# EasyEDA Pro project Projeto PCI - TCC Felipe_REV01.eprj

# Schematic Schematic1
Board Name: PCB2; Create Date: 2025-04-14; Page Name: P1; Project Name: TCC Felipe; Schematic Name: Schematic1; Update Date: 2025-06-02; Company: EasyEDA.com; Page Size: A4; Version: V1.0
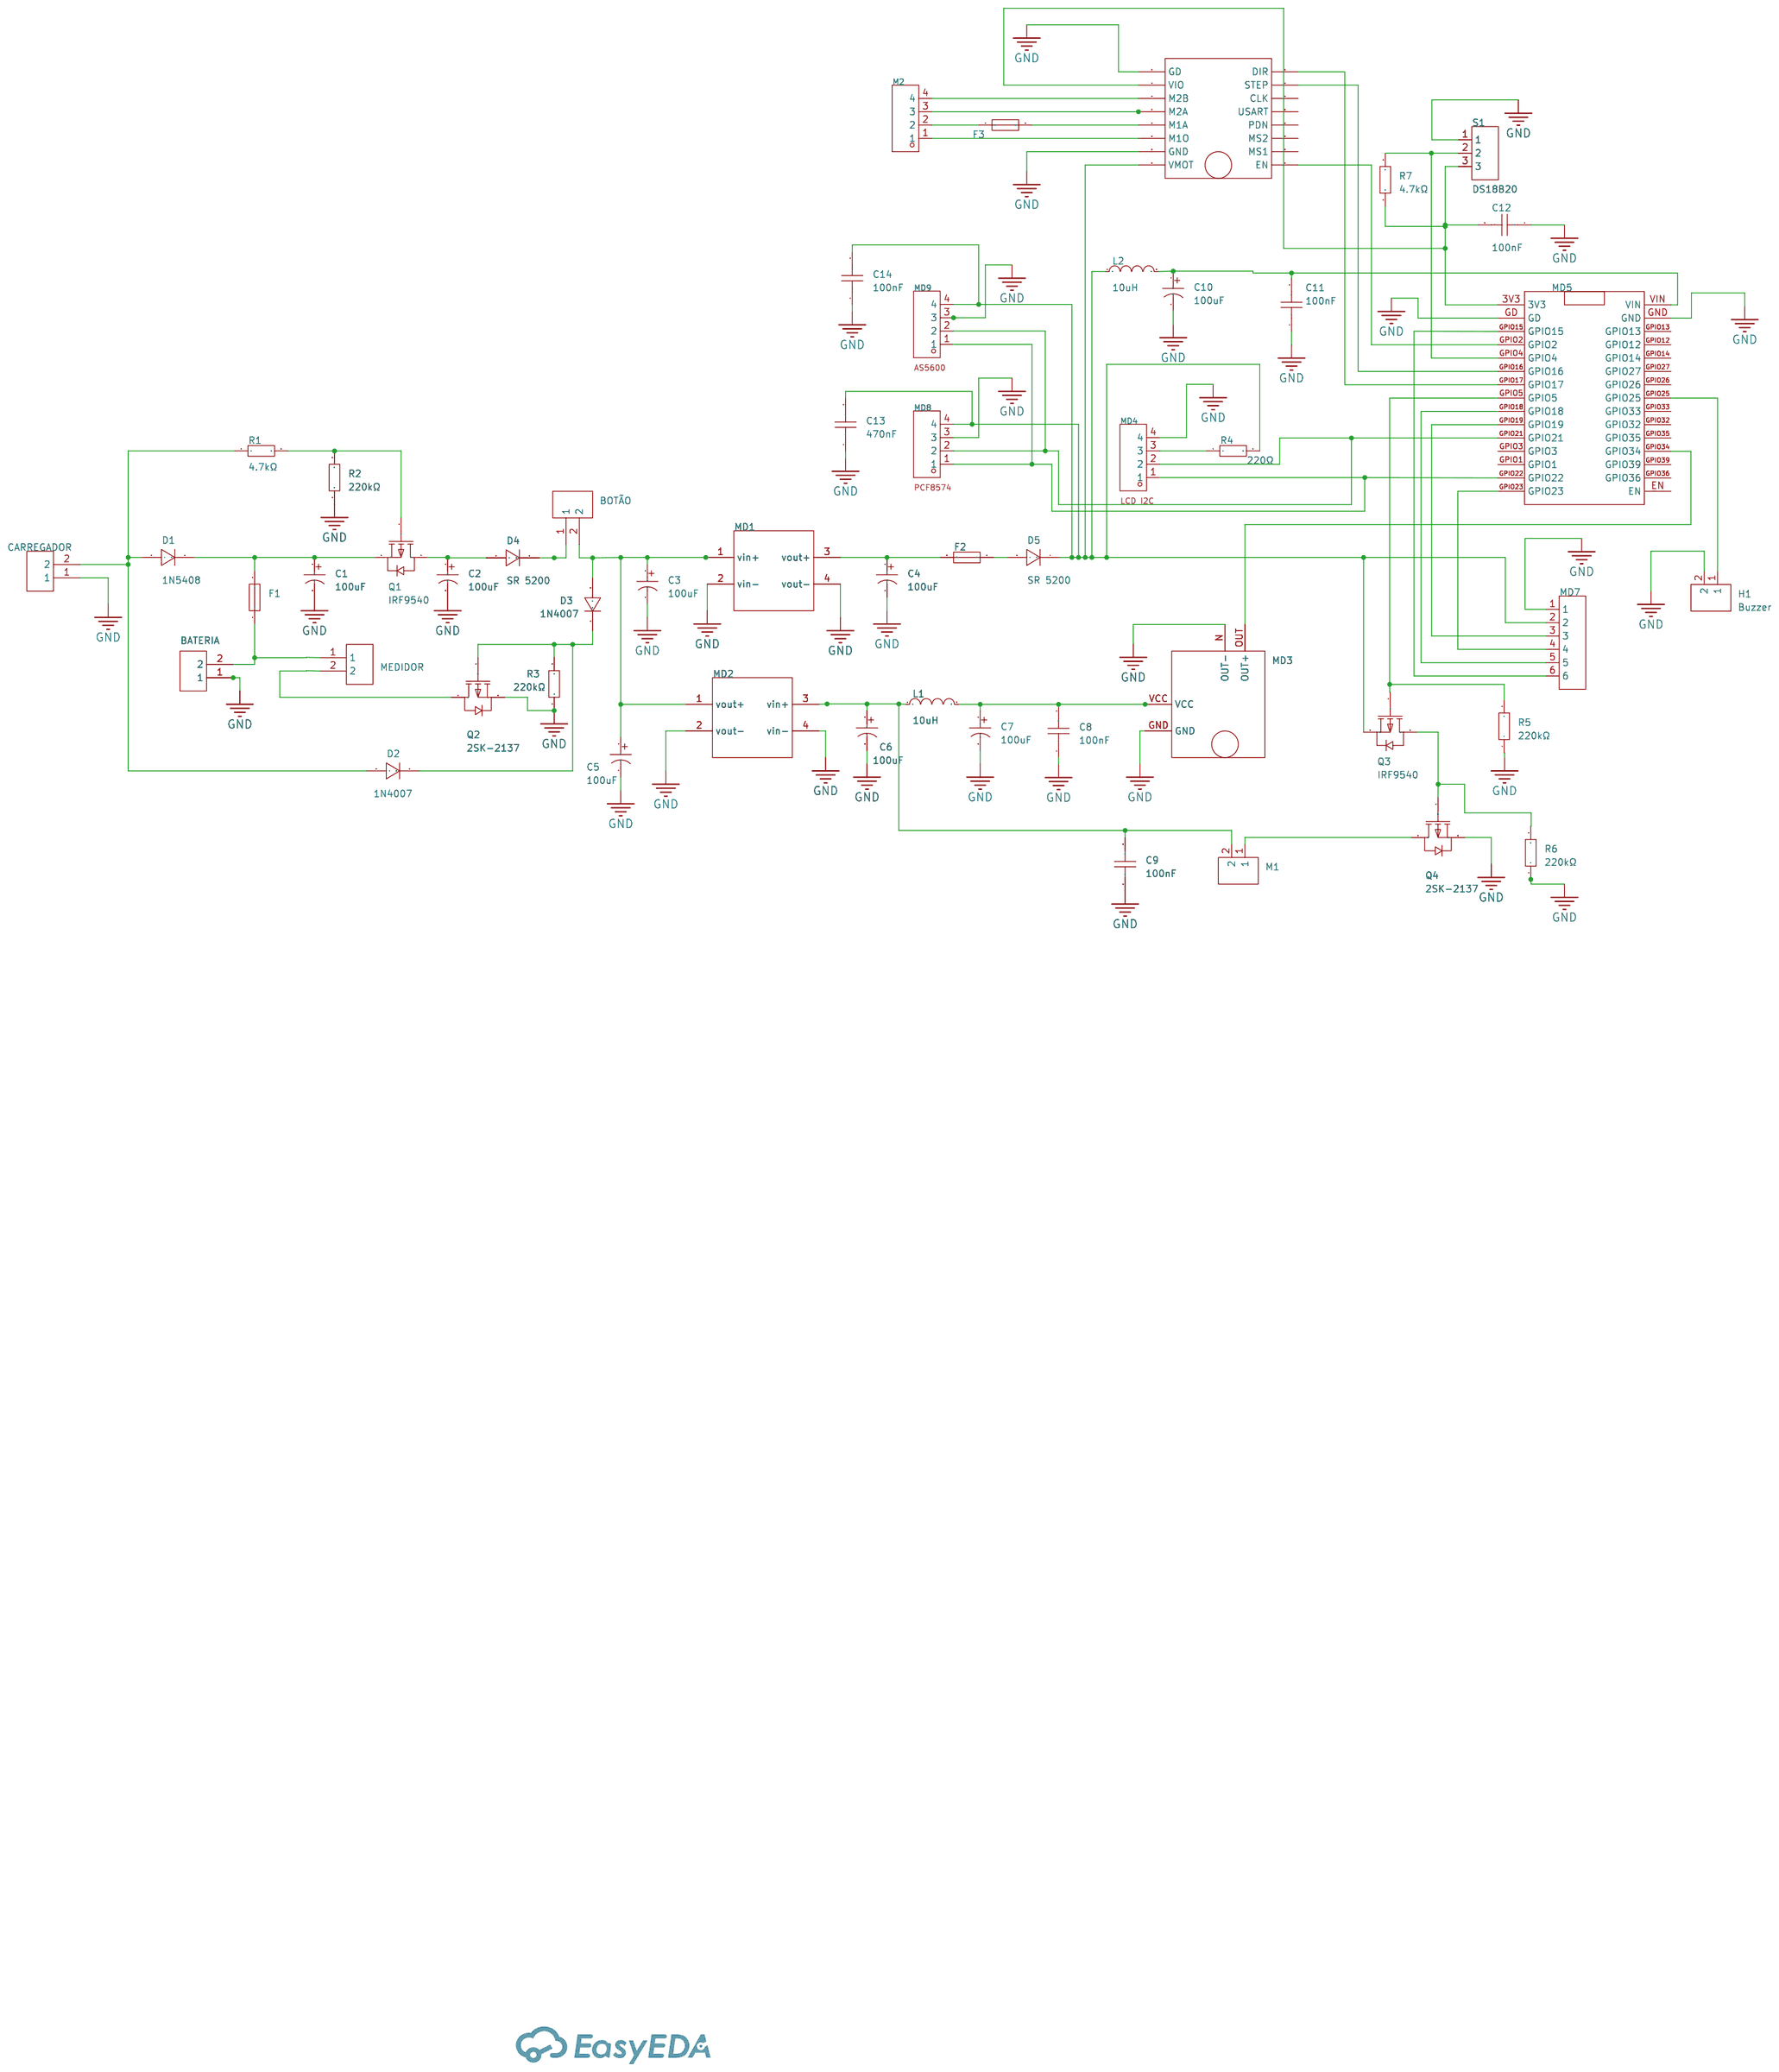
[diagram p0: schematic sheet]

## Parts
BATERIA  WJ500V-5.08-2P  [CONN-TH_2P-P5.00_WJ500V-5.08-2P]
BOTÃO  WJ500V-5.08-2P  [CONN-TH_2P-P5.00_WJ500V-5.08-2P]
C1  100uF  [CAP-TH_BD5.0-P2.00-D0.8-FD]
C2  100uF  [CAP-TH_BD5.0-P2.00-D0.8-FD]
C3  100uF  [CAP-TH_BD5.0-P2.00-D0.8-FD]
C4  100uF  [CAP-TH_BD5.0-P2.00-D0.8-FD]
C5  100uF  [CAP-TH_BD5.0-P2.00-D0.8-FD]
C6  100uF  [CAP-TH_BD5.0-P2.00-D0.8-FD]
C7  100uF  [CAP-TH_BD5.0-P2.00-D0.8-FD]
C8  100nF  [CAP-TH_L4.8-W2.4-P5.08-D0.6]
C9  100nF  [CAP-TH_L4.8-W2.4-P5.08-D0.6]
C10  100uF  [CAP-TH_BD5.0-P2.00-D0.8-FD]
C11  100nF  [CAP-TH_L4.8-W2.4-P5.08-D0.6]
C12  100nF  [CAP-TH_L4.8-W2.4-P5.08-D0.6]
C13  470nF  [CAP-TH_L4.8-W2.4-P5.08-D0.6]
C14  100nF  [CAP-TH_L4.8-W2.4-P5.08-D0.6]
CARREGADOR  WJ500V-5.08-2P  [CONN-TH_2P-P5.00_WJ500V-5.08-2P]
D1  1N5408  [DO-201_BD5.3-L9.5-P13.50-D1.4-RD]
D2  1N4007  [DO-201_BD5.3-L9.5-P13.50-D1.4-RD]
D3  1N4007  [DO-201_BD5.3-L9.5-P13.50-D1.4-RD]
D4  SR 5200  [DO-201_BD5.3-L9.5-P13.50-D1.4-RD]
D5  SR 5200  [DO-201_BD5.3-L9.5-P13.50-D1.4-RD]
F1  FH1-200CK-B  [FUSE-TH_L24.8-W9.8-P22.60]
F2  FH1-200CK-B  [FUSE-TH_L24.8-W9.8-P22.60]
F3  Fuse SPT478T400mA250V  [FUSE-TH_L8.4-W4.1-P5.08-D0.6]
H1  Buzzer  [HDR-TH_2P-P2.54-V-M]
L1  10uH  [axial inductor]
L2  10uH  [axial inductor]
M1  PH2.54-1X2P-H25  [HDR-TH_2P-P2.54-V-M-4]
M2  PZ254V-11-04P  [HDR-TH_4P-P2.54-V-M]
MD1  Xl4015  [Modulo Conversor Dc Step Down Abaixador 5a Xl4015]
MD2  SDB628  [Regulador de Tensão SDB628 Step Up]
MD3  AD8313  [AD8313]
MD4  2.54-1*4P母  [HDR-TH_4P-P2.54-V-F]
MD5  ESP32  [ESP32 DEV MODE]
MD6  TMC2208  [TMC2208]
MD7  HX PM2.54-1x6P ZC H11  [HDR-TH_6P-P2.54-V-F_4]
MD8  2.54-1*4P母  [HDR-TH_4P-P2.54-V-F]
MD9  2.54-1*4P母  [HDR-TH_4P-P2.54-V-F]
MEDIDOR  WJ500V-5.08-2P  [CONN-TH_2P-P5.00_WJ500V-5.08-2P]
Q1  IRF9540  [TO-220-3_L9.9-W4.5-P2.54-L-1]
Q2  2SK-2137  [TO-220-3_L10.0-W4.5-P2.54-L]
Q3  IRF9540  [TO-220-3_L9.9-W4.5-P2.54-L-1]
Q4  2SK-2137  [TO-220-3_L10.0-W4.5-P2.54-L]
R1  4.7kΩ  [RES-TH_BD2.3-L6.5-P10.50-D0.5]
R2  220kΩ  [RES-TH_BD2.3-L6.5-P10.50-D0.5]
R3  220kΩ  [RES-TH_BD2.3-L6.5-P10.50-D0.5]
R4  220Ω  [RES-TH_BD2.3-L6.5-P10.50-D0.5]
R5  220kΩ  [RES-TH_BD2.3-L6.5-P10.50-D0.5]
R6  220kΩ  [RES-TH_BD2.3-L6.5-P10.50-D0.5]
R7  4.7kΩ  [RES-TH_BD2.3-L6.5-P10.50-D0.5]
S1  DS18B20  [HDR-TH_3P-P2.54-V-F]

## Library data of the parts
BATERIA BOTÃO CARREGADOR MEDIDOR = WJ500V-5.08-2P: LCSC Part Name: 1x2P 5.08mm 直插 排数:1 每排P数:2; Supplier Part: C8465; Manufacturer: KANGNEX(康奈克斯电气); Supplier Footprint: 插件,P=5.08mm; JLCPCB Part Class: Extended Part; Datasheet: https://atta.szlcsc.com/upload/public/pdf/source/20191225/C8465_02D34CE5B5B4A53DF5891601D97FA9F4.pdf; Supplier: LCSC; Structure: 1x2P; Pitch: 5.08mm; Color: Green; Mounting Style: Direct Insert; Current Rating (Max): 18A; Voltage Rating (Max): 250V; Number of Pins: 2P; Number of Rows: 1; Wire Gauge - AWG: 14~30; Wire Gauge - mm2: 2.5; Number of PINs Per Row: 2; Operating Temperature Range: -40℃~+105℃; Screw Specification: M2.5
C1-C7 C10 = KS107M016D07RR0VH2FP0: LCSC Part Name: 100uF ±20% 16V; Supplier Part: C43803; Manufacturer: CX(承兴); Supplier Footprint: 插件,D5xL7mm; JLCPCB Part Class: Extended Part; Datasheet: https://atta.szlcsc.com/upload/public/pdf/source/20230817/0DB19D47181DB7F2222DAA6444591EF5.pdf; Supplier: LCSC; Tolerance: ±20%; Lifetime @ Temp: 1000hrs@105℃; Operating Temperature: -40℃~+105℃
C8 C9 C11-C14 = 178MU0009: LCSC Part Name: 470nF ±10% 50V; Supplier Part: C5632433; Manufacturer: KNSCHA(科尼盛); Supplier Footprint: 插件,P=5.08mm; JLCPCB Part Class: Extended Part; Datasheet: https://atta.szlcsc.com/upload/public/pdf/source/20230506/DCC14A9A0FEAEE97AA63FFA7A16A3B41.pdf; Supplier: LCSC; Tolerance: ±10%; Voltage Rating: 50V; Temperature Coefficient: X7R
D1 = 1N5408_C82807: Supplier Part: C82807; Manufacturer: LRC(乐山无线电); Supplier Footprint: DO-201AD; JLCPCB Part Class: Extended Part; Datasheet: https://atta.szlcsc.com/upload/public/pdf/source/20161024/1477288469472.pdf; Supplier: LCSC; Diode Configuration: Independent Type; Voltage - Forward(Vf@If): 1.2V@3A; Current - Rectified: 3A; Reverse Leakage Current (Ir): 5uA@1kV
D2-D5 = 1N5408_C82807: LCSC Part Name: 1N5408; Supplier Part: C82807; Manufacturer: LRC(乐山无线电); Supplier Footprint: DO-201AD; JLCPCB Part Class: Extended Part; Datasheet: https://atta.szlcsc.com/upload/public/pdf/source/20161024/1477288469472.pdf; Supplier: LCSC; Diode Configuration: Independent Type; Voltage - Forward(Vf@If): 1.2V@3A; Current - Rectified: 3A; Reverse Leakage Current (Ir): 5uA@1kV
F1 F2 = FH1-200CK-B: LCSC Part Name: 两件套 保险丝夹5*20黑色（两件套）; Supplier Part: C268205; Manufacturer: HONGJU(宏聚); Supplier Footprint: 插件; JLCPCB Part Class: Extended Part; Datasheet: https://atta.szlcsc.com/upload/public/pdf/source/20190802/C268205_A421C231E53844EC97EC198CC4695A68.pdf; Supplier: LCSC
F3 = Fuse SPT478T400mA250V: Type:Square Fuse Current Rating:400mA Voltage Rating (AC):250V Voltage Rating (DC):125V Operating Temperature:-55℃~+125℃ Operating Temperature:-55℃~+125℃ Interrupt Rating:150A@250VAC; LCSC Part Name: 400mA 250VAC 慢断; Supplier Part: C2995764; Manufacturer: SET(赛尔特); Supplier Footprint: 插件; JLCPCB Part Class: Extended Part; Datasheet: https://atta.szlcsc.com/upload/public/pdf/source/20220512/1DE9E7A91927E3FAADADA621F21C7EED.pdf; Supplier: LCSC; Type: Square Fuse; Current Rating: 400mA; Voltage Rating (AC): 250V; Voltage Rating (DC): 125V; Operating Temperature: -55℃~+125℃; Interrupt Rating: 150A@250VAC
H1 = PZ254V-11-02P: LCSC Part Name: 1x2P 间距:2.54mm 方针 直插; Supplier Part: C492401; Manufacturer: XFCN(兴飞); Supplier Footprint: 插件,P=2.54mm; JLCPCB Part Class: Extended Part; Datasheet: https://atta.szlcsc.com/upload/public/pdf/source/20200309/C492401_A812433581A9B211A7FFA413ADDFF0E5.pdf; Supplier: LCSC; Pin Structure: 1x2P; Pitch: 2.54mm; Circluar Pins/Square Pins: Policy; Mounting Type: Straight; Number of Rows: Single Row; Number of Pins: 2P; Length of Mating Pin: 6mm; Insulation Height: 2.5mm; Length of End Connection Pin: 3mm; Contact Material: Brass; Operating Temperature: -40℃~+105℃; Color: Black
L1 L2 = axial inductor
M1 = PH2.54-1X2P-H25: Supplier Part: C42431798; Manufacturer: JXTCONN(聚兴泰); Supplier Footprint: 插件,P=2.54mm; Datasheet: https://atta.szlcsc.com/upload/public/pdf/source/20241230/202EFE71BA0218E4180A97322F8770D7.pdf; Supplier: LCSC
M2 = PZ254V-11-04P: LCSC Part Name: 间距:2.54mm 1x4P 直插 方针; Supplier Part: C2691448; Manufacturer: XFCN(兴飞); Supplier Footprint: 插件,P=2.54mm; JLCPCB Part Class: Extended Part; Datasheet: https://atta.szlcsc.com/upload/public/pdf/source/20200309/C492403_F9F19131791D08044AD4F84F8E751A34.pdf; Supplier: LCSC; Pin Structure: 1x4P; Pitch: 2.54mm; Circluar Pins/Square Pins: Square Pins; Mounting Type: Straight; Number of Rows: Plugin; Number of Pins: 4P; Current Rating (Max): 3A; Voltage Rating (Max): 250V; Length of Mating Pin: 6mm; Insulation Height: 2.5mm; Length of End Connection Pin: 3mm; Operating Temperature Range: -40℃~+105℃; Color: Black
MD1 = Module  Xl4015
MD2 = Regulador de Tensão SDB628 Step Up
MD3 = módulo da detecção da radiofrequência AD8313
MD4 = 2.54-1*4P母: LCSC Part Name: 间距:2.54mm 1x4P 直插; Supplier Part: C2718488; Manufacturer: LCD I2C; Supplier Footprint: 插件,P=2.54mm; JLCPCB Part Class: Extended Part; Datasheet: https://atta.szlcsc.com/upload/public/pdf/source/20210301/C2718488_F4427B881E42CAA8DDB0B1C12B3A522C.pdf; Supplier: LCSC; Holes Structure: 1x4P; Pitch: 2.54mm; Circular Hole / Square Hole: Square Holes; Mounting Type: Straight; Number of Rows: Plugin; Number of Holes: 4P; Current Rating (Max): 3A; Holes Direction: Top; Contact Material: bronze; Operating Temperature Range: -40℃~+105℃
MD5 = ESP32 DEV MODE
MD6 = Driver Motor de Passo TMC2208
MD7 = HX PM2.54-1x6P ZC H11: LCSC Part Name: 1x6P 间距:2.54mm 直插; Supplier Part: C41427521; Manufacturer: hanxia(韩下); Supplier Footprint: 插件,P=2.54mm; JLCPCB Part Class: Extended Part; Datasheet: https://atta.szlcsc.com/upload/public/pdf/source/20241011/FC6480F416A05A484ECA158C50450AEF.pdf; Supplier: LCSC; Holes Structure: 1x6P; Pitch: 2.54mm; Circular Hole / Square Hole: Square Hole; Mounting Type: Direct Insert; Number of Rows: Single Row; Number of Positions: 6P; Current Rating: 3A; Holes Direction: Top; Insulation Height: 11mm; Contact Plating: Gold; Operating Temperature: -40℃~+105℃; PIN Length: 3.2mm
MD8 = 2.54-1*4P母: LCSC Part Name: 间距:2.54mm 1x4P 直插; Supplier Part: C2718488; Manufacturer: PCF8574; Supplier Footprint: 插件,P=2.54mm; JLCPCB Part Class: Extended Part; Datasheet: https://atta.szlcsc.com/upload/public/pdf/source/20210301/C2718488_F4427B881E42CAA8DDB0B1C12B3A522C.pdf; Supplier: LCSC; Holes Structure: 1x4P; Pitch: 2.54mm; Circular Hole / Square Hole: Square Holes; Mounting Type: Straight; Number of Rows: Plugin; Number of Holes: 4P; Current Rating (Max): 3A; Holes Direction: Top; Contact Material: bronze; Operating Temperature Range: -40℃~+105℃
MD9 = 2.54-1*4P母: LCSC Part Name: 间距:2.54mm 1x4P 直插; Supplier Part: C2718488; Manufacturer: AS5600; Supplier Footprint: 插件,P=2.54mm; JLCPCB Part Class: Extended Part; Datasheet: https://atta.szlcsc.com/upload/public/pdf/source/20210301/C2718488_F4427B881E42CAA8DDB0B1C12B3A522C.pdf; Supplier: LCSC; Holes Structure: 1x4P; Pitch: 2.54mm; Circular Hole / Square Hole: Square Holes; Mounting Type: Straight; Number of Rows: Plugin; Number of Holes: 4P; Current Rating (Max): 3A; Holes Direction: Top; Contact Material: bronze; Operating Temperature Range: -40℃~+105℃
Q1 Q3 = IRF9540_C7496537: LCSC Part Name: P沟道,电流:-20A,耐压:-100V; Supplier Part: C7496537; Manufacturer: Slkor(萨科微); Supplier Footprint: TO-220; JLCPCB Part Class: Extended Part; Datasheet: https://atta.szlcsc.com/upload/public/pdf/source/20230809/310EFFAEBFCCC294A87EA71D86FED7F8.pdf; Supplier: LCSC; Type: 1 piece P-channel; Current - Continuous Drain(Id): 20A; RDS(on): 90mΩ@10V,10A; Pd - Power Dissipation: 58W; Gate Threshold Voltage (Vgs(th)@Id): 1.7V; Gate Charge(Qg): 44nC@10V; Input Capacitance(Ciss@Vds): 3020pF@20V; Reverse Transfer Capacitance (Crss@Vds): 73pF@20V; Operating Temperature: -55℃~+150℃
Q2 Q4 = IRF640N: LCSC Part Name: 18A200V MOS管; Supplier Part: C20607744; Manufacturer: OSEN(欧芯); Supplier Footprint: TO-220; JLCPCB Part Class: Extended Part; Datasheet: https://atta.szlcsc.com/upload/public/pdf/source/20240119/38AED5AA1E8F4E8AF5B3DB23A526BFC1.pdf; Supplier: LCSC
R1-R7 = MF1/4W-4.7KΩ±1% T: LCSC Part Name: 4.7kΩ ±1% 250mW 金属膜电阻; Supplier Part: C119339; Manufacturer: CCO(千志电子); Supplier Footprint: 插件,D2.3xL6.5mm; JLCPCB Part Class: Extended Part; Datasheet: https://atta.szlcsc.com/upload/public/pdf/source/20190910/C427326_62A6D058BC0FF74963A2F22379CA06CE.pdf; Supplier: LCSC; Type: Metal Film Resistors; Tolerance: ±1%; Voltage-Supply(Max): 250V; Power(Watts): 250mW; Temperature Coefficient: ±100ppm/℃; Operating Temperature: -55℃~+155℃
S1 = PM254V-11-03-H85: LCSC Part Name: 间距:2.54mm 1x3P 直插; Supplier Part: C541850; Manufacturer: XFCN(兴飞); Supplier Footprint: 插件,P=2.54mm; JLCPCB Part Class: Extended Part; Datasheet: https://atta.szlcsc.com/upload/public/pdf/source/20200518/C541849_85853D71FC67C51915A806977A588FDA.pdf; Supplier: LCSC; Holes Structure: 1x3P; Pitch: 2.54mm; Mounting Type: Straight; Number of Rows: Plugin; Number of Holes: 3P; Contact Material: Brass

## Nets
GND: BATERIA.1 C1.2 C2.2 C3.2 C4.2 C5.2 C6.2 C7.2 C8.1 C9.1 C10.2 C11.1 C12.1 C13.1 C14.1 CARREGADOR.1 H1.2 MD1.2(vin-) MD1.4(vout-) MD2.2(vout-) MD2.4(vin-) MD3.GND MD3.N(OUT-) MD4.4 MD5.GD MD5.GND MD6.GD MD6.GND MD8.3 MD9.3 Q2.3(S) Q4.3(S) R2.1 R3.1 R5.1 R6.1 S1.1
$1N321: C1.1 D1.1(C) F1.2 Q1.3(S)
$1N912: Q1.1(G) R1.2 R2.2
$1N4114: C4.1 F2.2 MD1.3(vout+)
$1N4194: D5.2(A) F2.1
$1N4395: C6.1 C9.2 L1.1 M1.2 MD2.3(vin+)
$1N4510: C7.1 C8.2 L1.2 MD3.VCC
$1N7454: MD4.3 R4.1
$1N8461: MD4.1 MD5.GPIO22 MD8.1 MD9.1
$1N8467: MD4.2 MD5.GPIO21 MD8.2 MD9.2
$1N9630: C10.1 C11.2 L2.2 MD5.VIN
$1N9640: C13.2 C14.2 D5.1(C) L2.1 MD6.VMOT MD7.2 MD8.4 MD9.4 Q3.3(S) R4.2
$1N9844: C12.2 MD5.3V3 MD6.VIO R7.2 S1.3
$1N10485: M2.3 MD6.M2A
$1N10698: MD5.GPIO19 MD7.3
$1N10715: MD5.GPIO23 MD7.4
$1N10748: MD5.GPIO15 MD7.6
$1N11007: Q3.2(D) Q4.1(G) R6.2
$1N11460: M1.1 Q4.2(D)
$1N15204: MD5.GPIO18 MD7.5
$1N15211: MD5.GPIO17 MD6.DIR
$1N15215: MD5.GPIO16 MD6.STEP
$1N15225: MD5.GPIO2 MD6.EN
$1N15233: MD5.GPIO4 R7.1 S1.2
$1N16744: MD3.OUT(OUT+) MD5.GPIO34
$1N18247: M2.4 MD6.M2B
$1N18259: F3.1 M2.2
$1N18264: F3.2 MD6.M1A
$1N18269: M2.1 MD6.M1O
$1N18350: BATERIA.2 F1.1 MEDIDOR.1
$1N18358: MEDIDOR.2 Q2.2(D)
$1N24733: C2.1 D4.2(A) Q1.2(D)
$1N27613: CARREGADOR.2 D1.2(A) D2.2(A) R1.1
$1N27677: D2.1(C) D3.1(C) Q2.1(G) R3.2
$1N27773: H1.1 MD5.GPIO25
$1N29243: BOTÃO.1 D4.1(C)
$1N29257: BOTÃO.2 C3.1 C5.1 D3.2(A) MD1.1(vin+) MD2.1(vout+)
Net-(MD5-GPIO5): MD5.GPIO5 Q3.1(G)

Not connected (* = marked no-connect by the designer): MD5 EN GPIO1 GPIO3 GPIO12 GPIO13 GPIO14 GPIO26 GPIO27 GPIO32 GPIO33 GPIO35 GPIO36 GPIO39; MD6 CLK MS1 MS2 PDN USART; MD7 1; R5 2

# Board PCB3
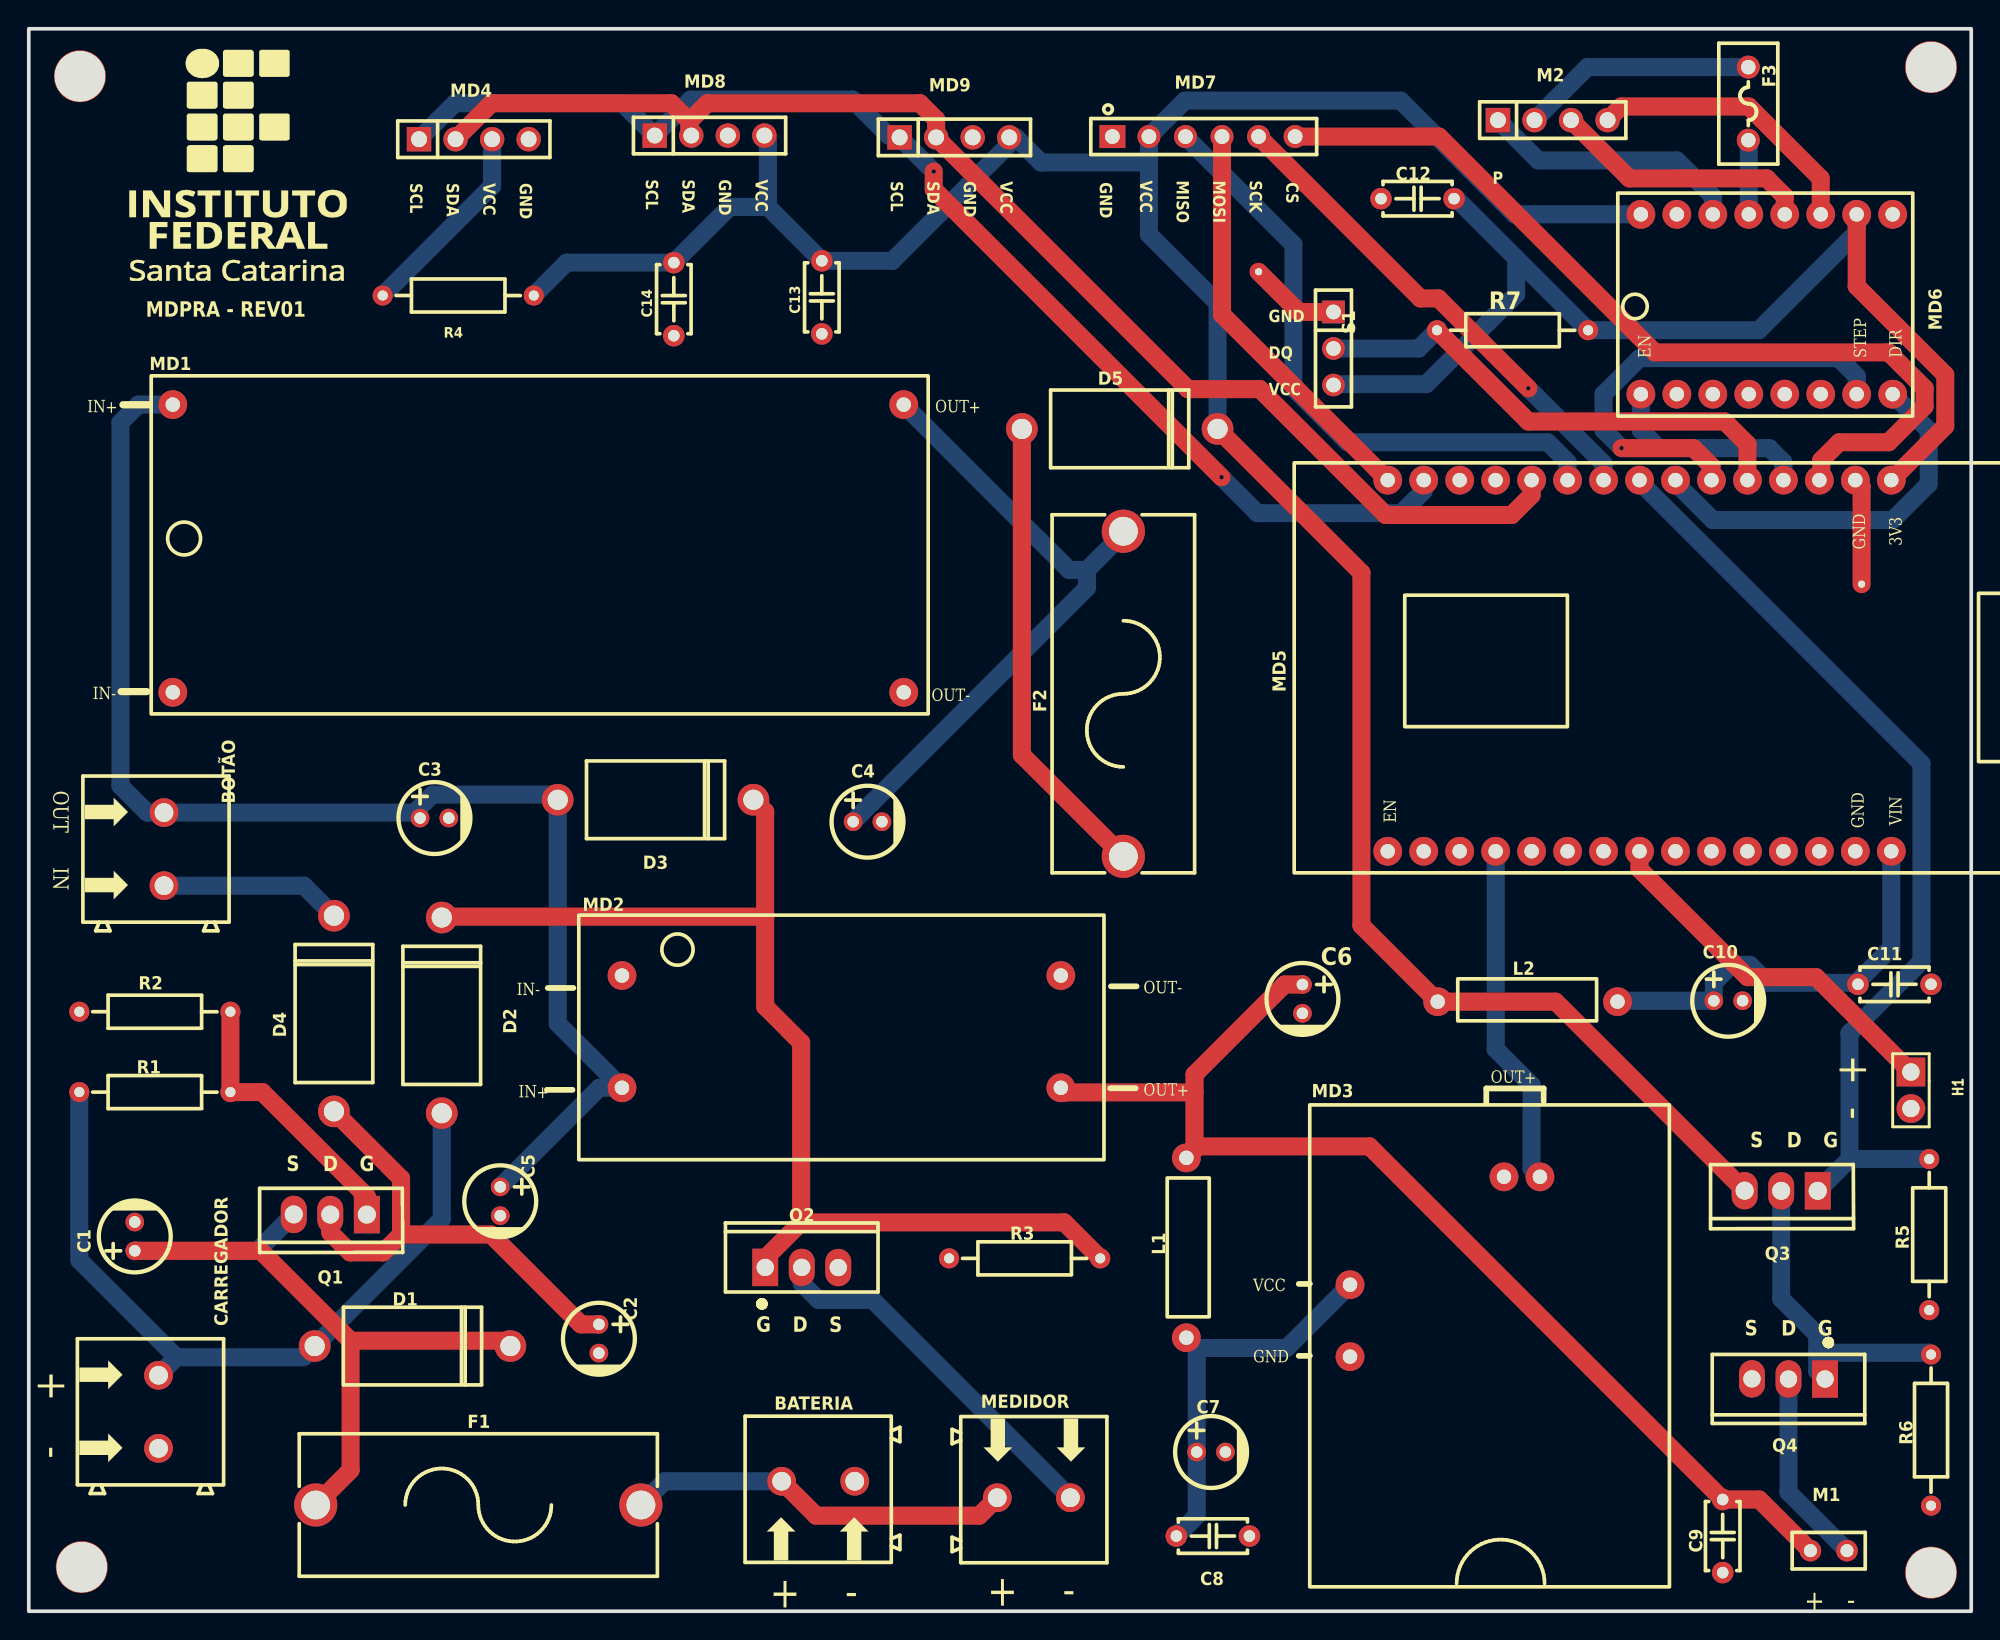
[diagram p1: board, top side]
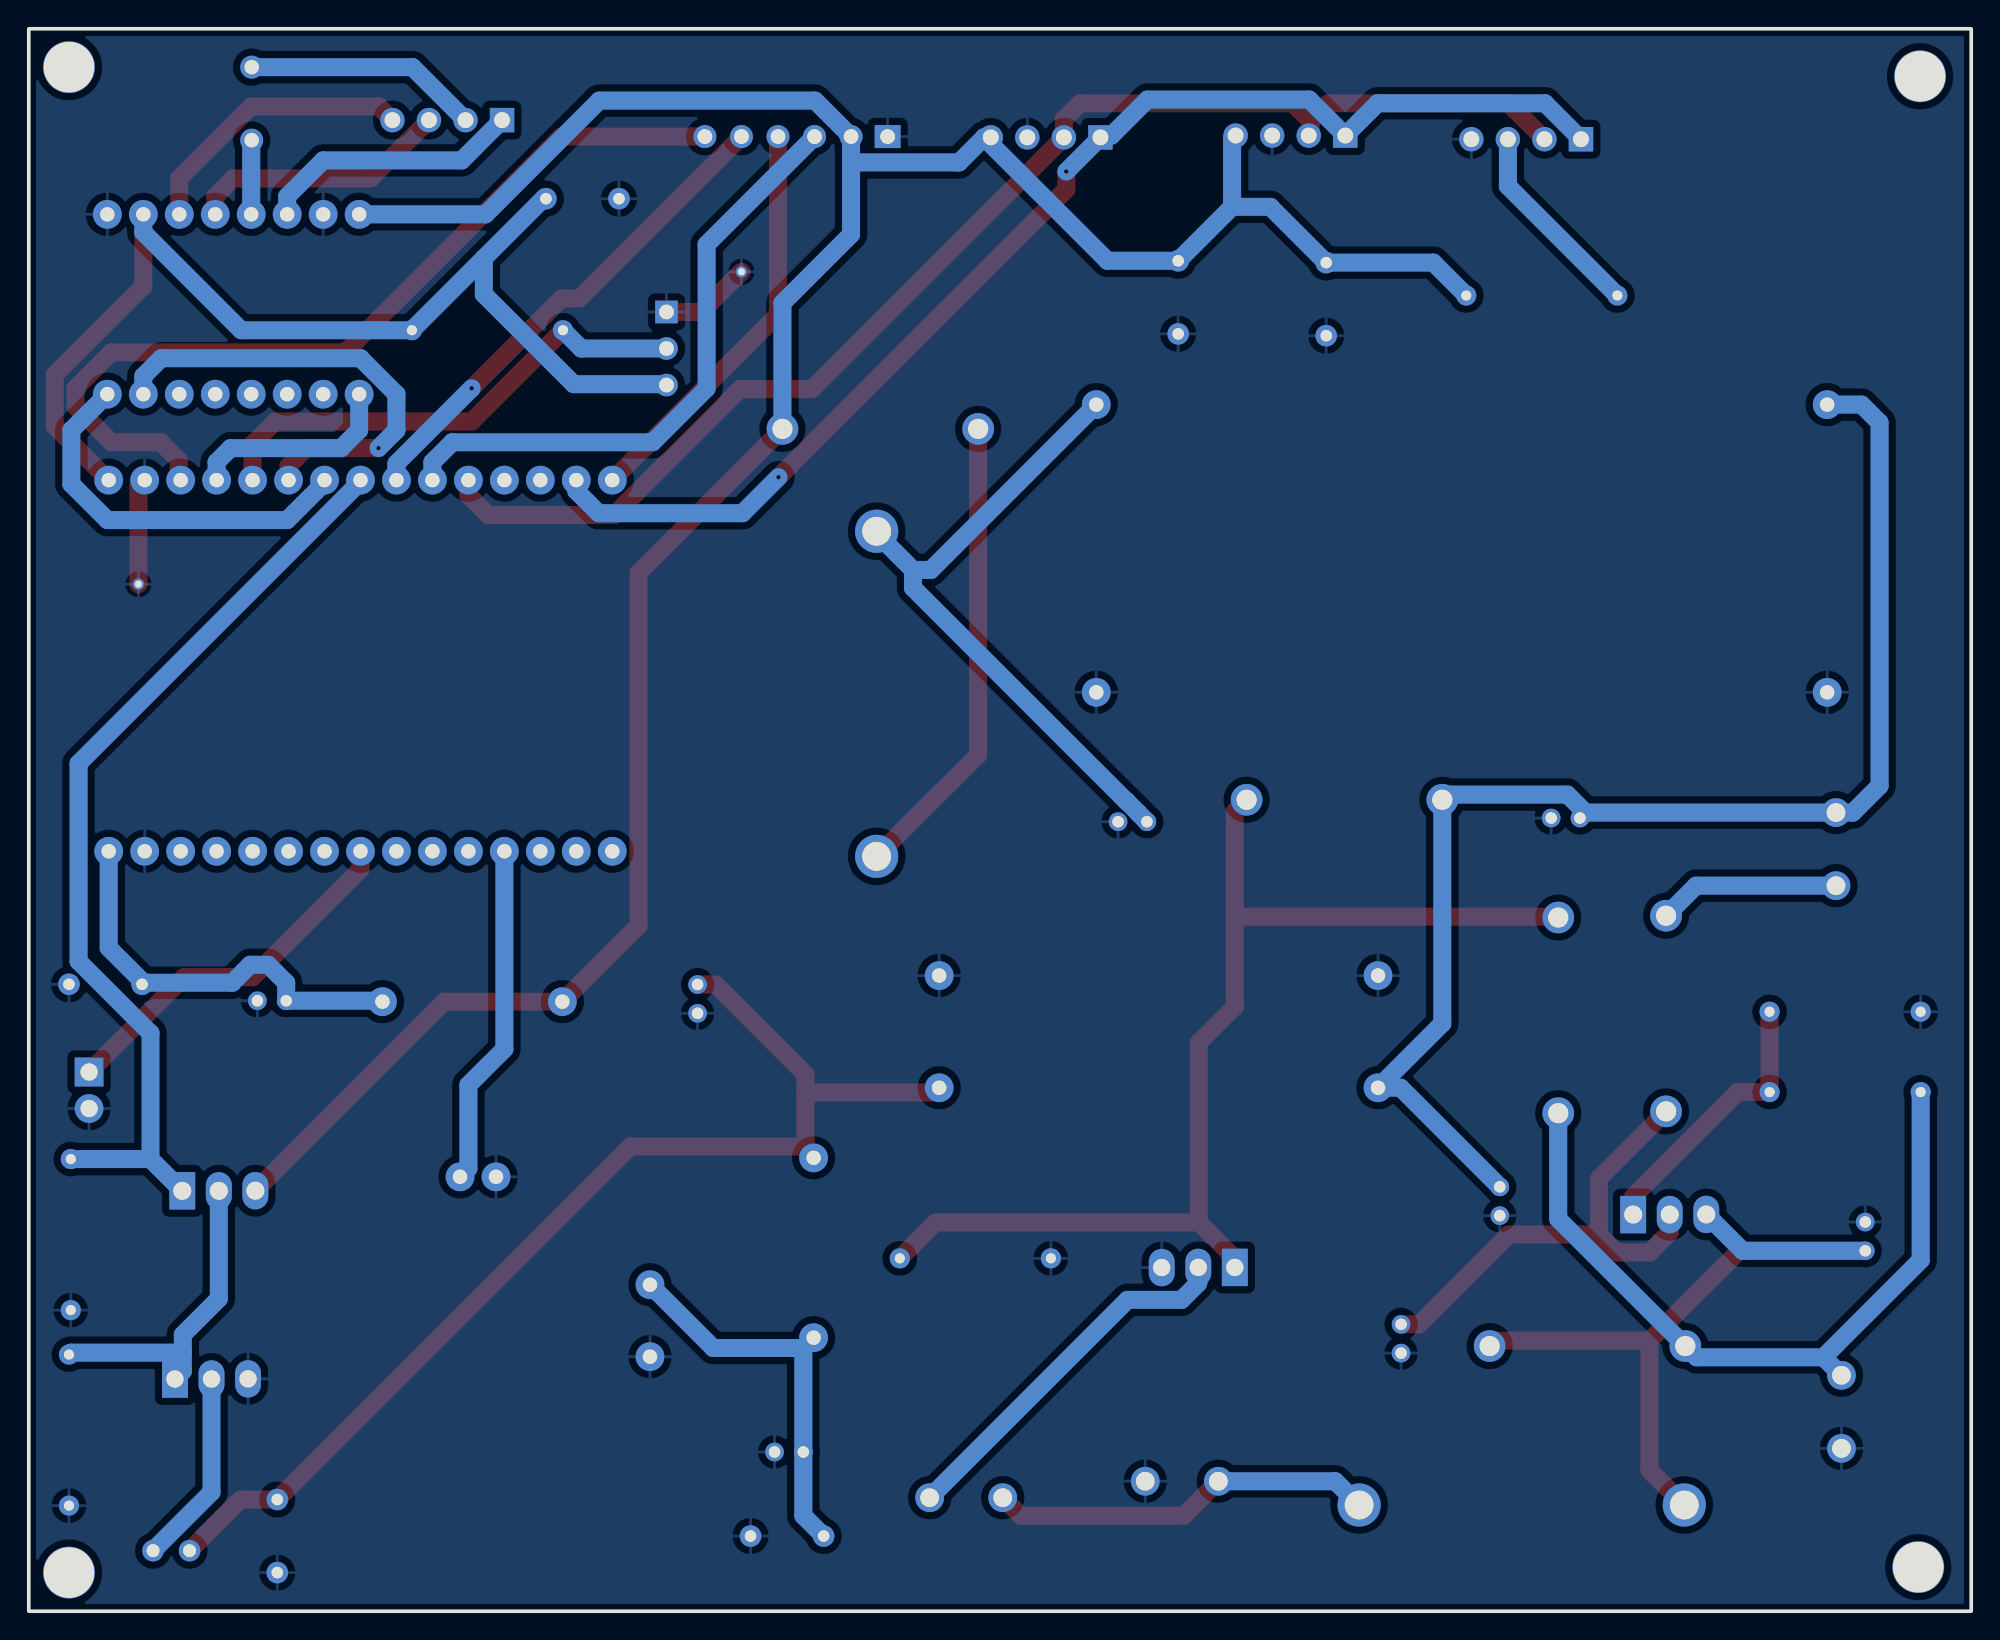
[diagram p2: board, bottom side, seen from below]

Outline 135 x 110 mm; copper layers: Top Layer, Bottom Layer. Coordinates in mm from the lower left corner of the outline.
Outline path: rectangle 0,110 135,0
Stack: Top Layer 0.035mm / Dielectric1 1.51mm FR4 er 4.5 / Bottom Layer 0.035mm

## Design rules (mm)
template: Custom Config
spacing copperThickness1oz (default): track to track 0.102, other pairs 0.152 to 0.3
spacing copperThickness2oz: track to track 0.203, other pairs 0.152 to 0.3
track width copperThickness1oz (default): min 1.25, default 1.25, max 2.54
track width copperThickness2oz: min 1, default 1, max 2.54
differential pair differentialPair (default): width min 0.127, default 0.254, max 2.54; gap min 0.152, default 0.152
via viaSize (default): diameter min 0.5, default 0.61, max 10; hole min 0.3, default 0.305, max 6.3

## Placement (name value [footprint] x y rotation side)
BATERIA  WJ500V-5.08-2P  [CONN-TH_2P-P5.00_WJ500V-5.08-2P]  54.86 9.03 180 top
BOTÃO  WJ500V-5.08-2P  [CONN-TH_2P-P5.00_WJ500V-5.08-2P]  9.4 52.98 90 top
C1  100uF  [CAP-TH_BD5.0-P2.00-D0.8-FD]  7.37 26.05 90 top
C2  100uF  [CAP-TH_BD5.0-P2.00-D0.8-FD]  39.62 18.94 270 top
C3  100uF  [CAP-TH_BD5.0-P2.00-D0.8-FD]  28.19 55.14 0 top
C4  100uF  [CAP-TH_BD5.0-P2.00-D0.8-FD]  58.29 54.88 0 top
C5  100uF  [CAP-TH_BD5.0-P2.00-D0.8-FD]  32.77 28.5 270 top
C6  100uF  [CAP-TH_BD5.0-P2.00-D0.8-FD]  88.52 42.56 270 top
C7  100uF  [CAP-TH_BD5.0-P2.00-D0.8-FD]  82.17 11.07 0 top
C8  100nF  [CAP-TH_L4.8-W2.4-P5.08-D0.6]  82.3 5.22 180 top
C9  100nF  [CAP-TH_L4.8-W2.4-P5.08-D0.6]  117.73 5.22 90 top
C10  100uF  [CAP-TH_BD5.0-P2.00-D0.8-FD]  118.11 42.44 0 top
C11  100nF  [CAP-TH_L4.8-W2.4-P5.08-D0.6]  129.67 43.58 180 top
C12  100nF  [CAP-TH_L4.8-W2.4-P5.08-D0.6]  96.52 98.19 0 top
C13  470nF  [CAP-TH_L4.8-W2.4-P5.08-D0.6]  55.12 91.33 90 top
C14  100nF  [CAP-TH_L4.8-W2.4-P5.08-D0.6]  44.83 91.2 90 top
CARREGADOR  WJ500V-5.08-2P  [CONN-TH_2P-P5.00_WJ500V-5.08-2P]  9.02 13.86 90 top
D1  1N5408  [DO-201_BD5.3-L9.5-P13.50-D1.4-RD]  26.67 18.43 180 top
D2  1N4007  [DO-201_BD5.3-L9.5-P13.50-D1.4-RD]  28.7 41.42 270 top
D3  1N4007  [DO-201_BD5.3-L9.5-P13.50-D1.4-RD]  43.56 56.41 180 top
D4  SR 5200  [DO-201_BD5.3-L9.5-P13.50-D1.4-RD]  21.21 41.55 270 top
D5  SR 5200  [DO-201_BD5.3-L9.5-P13.50-D1.4-RD]  75.82 82.19 180 top
F1  FH1-200CK-B  [FUSE-TH_L24.8-W9.8-P22.60]  31.24 7.38 180 top
F2  FH1-200CK-B  [FUSE-TH_L24.8-W9.8-P22.60]  76.07 63.77 90 top
F3  Fuse SPT478T400mA250V  [FUSE-TH_L8.4-W4.1-P5.08-D0.6]  119.51 104.79 270 top
H1  Buzzer  [HDR-TH_2P-P2.54-V-M]  130.81 36.21 270 top
L1  10uH  [axial inductor]  78.61 33.55 270 top
L2  10uH  [axial inductor]  95.89 40.53 0 top
M1  PH2.54-1X2P-H25  [HDR-TH_2P-P2.54-V-M-4]  125.09 4.21 180 top
M2  PZ254V-11-04P  [HDR-TH_4P-P2.54-V-M]  105.92 103.65 0 top
MD1  Xl4015  [Modulo Conversor Dc Step Down Abaixador 5a Xl4015]  8.51 62.38 0 top
MD2  SDB628  [Regulador de Tensão SDB628 Step Up]  38.23 31.39 0 top
MD3  -  [AD8313]  89.03 35.2 270 top
MD4  2.54-1*4P母  [HDR-TH_4P-P2.54-V-F]  30.93 102.32 0 top
MD5  ESP32  [ESP32 DEV MODE]  139.45 51.33 90 top
MD6  -  [TMC2208]  133.6 80.79 90 top
MD7  HX PM2.54-1x6P ZC H11  [HDR-TH_6P-P2.54-V-F_4]  81.66 102.51 0 top
MD8  2.54-1*4P母  [HDR-TH_4P-P2.54-V-F]  47.31 102.58 0 top
MD9  2.54-1*4P母  [HDR-TH_4P-P2.54-V-F]  64.33 102.45 0 top
MEDIDOR  WJ500V-5.08-2P  [CONN-TH_2P-P5.00_WJ500V-5.08-2P]  69.85 7.89 0 top
NOREF  -  [Pad_e8990]  3.68 3.07 0 top
NOREF#2  -  [Pad_e8991]  132.21 2.69 0 top
NOREF#3  -  [Pad_e3385]  127.38 71.39 0 top
NOREF#4  -  [Pad_e3757]  85.47 93.11 0 top
NOREF#5  -  [Pad_e8989]  132.21 107.33 0 top
NOREF#6  -  [Pad_e8987]  3.56 106.7 0 top
Q1  IRF9540  [TO-220-3_L9.9-W4.5-P2.54-L-1]  20.95 27.58 180 top
Q2  2SK-2137  [TO-220-3_L10.0-W4.5-P2.54-L]  53.72 23.89 0 top
Q3  IRF9540  [TO-220-3_L9.9-W4.5-P2.54-L-1]  121.79 29.23 180 top
Q4  2SK-2137  [TO-220-3_L10.0-W4.5-P2.54-L]  122.3 16.15 180 top
R1  4.7kΩ  [RES-TH_BD2.3-L6.5-P10.50-D0.5]  8.76 36.09 0 top
R2  220kΩ  [RES-TH_BD2.3-L6.5-P10.50-D0.5]  8.76 41.67 0 top
R3  220kΩ  [RES-TH_BD2.3-L6.5-P10.50-D0.5]  69.21 24.53 0 top
R4  220Ω  [RES-TH_BD2.3-L6.5-P10.50-D0.5]  29.84 91.46 0 top
R5  220kΩ  [RES-TH_BD2.3-L6.5-P10.50-D0.5]  132.08 26.18 90 top
R6  220kΩ  [RES-TH_BD2.3-L6.5-P10.50-D0.5]  132.21 12.59 90 top
R7  4.7kΩ  [RES-TH_BD2.3-L6.5-P10.50-D0.5]  103.12 89.04 0 top
S1  DS18B20  [HDR-TH_3P-P2.54-V-F]  90.68 87.77 270 top

## Footprints (pads in the part's own frame, mm; a bottom-side part is the same pattern mirrored in y, then rotated)
AD8313
  round 2 hole 1: GND(17.5,2.8) N(5,13.5) OUT(5,16) VCC(12.5,2.8)
axial inductor
  round 2 hole 1: 1(2.032,1.841) 2(14.532,1.841)
CAP-TH_BD5.0-P2.00-D0.8-FD
  round 1.3 hole 0.8: 1(-1,0) 2(1,0)
CAP-TH_L4.8-W2.4-P5.08-D0.6
  round 1.5 hole 0.8: 1(-2.54,0) 2(2.54,0)
CONN-TH_2P-P5.00_WJ500V-5.08-2P
  round 2 hole 1.3: 1(-2.54,0) 2(2.54,0)
DO-201_BD5.3-L9.5-P13.50-D1.4-RD
  round 2.2 hole 1.4: 1(-6.8,0) 2(6.8,0)
ESP32 DEV MODE
  round 2 hole 1: 3V3(27.3,10) EN(1.5,45) GD(27.3,12.5) GND(1.5,12.5) GPIO1(27.3,40) GPIO2(27.3,17.5) GPIO3(27.3,37.5) GPIO4(27.3,20) GPIO5(27.3,27.5) GPIO12(1.5,17.5) GPIO13(1.5,15) GPIO14(1.5,20) GPIO15(27.3,15) GPIO16(27.3,22.5) GPIO17(27.3,25) GPIO18(27.3,30) GPIO19(27.3,32.5) GPIO21(27.3,35) GPIO22(27.3,42.5) GPIO23(27.3,45) GPIO25(1.5,27.5) GPIO26(1.5,25) GPIO27(1.5,22.5) GPIO32(1.5,32.5) GPIO33(1.5,30) GPIO34(1.5,37.5) GPIO35(1.5,35) GPIO36(1.5,42.5) GPIO39(1.5,40) VIN(1.5,10)
FUSE-TH_L8.4-W4.1-P5.08-D0.6
  round 1.6 hole 1: 1(-2.54,0) 2(2.54,0)
FUSE-TH_L24.8-W9.8-P22.60
  round 3 hole 2: 1(-11.3,0) 2(11.3,0)
HDR-TH_2P-P2.54-V-M
  rect 2x2 hole 1.2: 1(-1.27,0)
  round 2 hole 1.2: 2(1.27,0)
HDR-TH_2P-P2.54-V-M-4
  round 1.5 hole 0.9: 1(-1.27,0) 2(1.27,0)
HDR-TH_3P-P2.54-V-F
  rect 1.575x1.575 hole 1.02: 1(-2.54,0)
  round 1.575 hole 1.02: 2(0,0) 3(2.54,0)
HDR-TH_4P-P2.54-V-F
  rect 1.7x1.7 hole 1.1: 1(-3.81,0)
  round 1.7 hole 1.1: 2(-1.27,0) 3(1.27,0) 4(3.81,0)
HDR-TH_4P-P2.54-V-M
  rect 1.7x1.7 hole 1.1: 1(-3.81,0)
  round 1.7 hole 1.1: 2(-1.27,0) 3(1.27,0) 4(3.81,0)
HDR-TH_6P-P2.54-V-F_4
  rect 1.8x1.6 hole 1.02: 1(-6.35,0)
  round 1.6 hole 1.02: 2(-3.81,0) 3(-1.27,0) 4(1.27,0) 5(3.81,0) 6(6.35,0)
Modulo Conversor Dc Step Down Abaixador 5a Xl4015
  round 2 hole 1: 1(1.5,21.5) 2(1.5,1.5) 3(52.3,21.5) 4(52.3,1.5)
Pad_e3385
  round 0.8 hole 0.5: 1(0,0)
Pad_e3757
  round 0.8 hole 0.5: 1(0,0)
Pad_e8987
  round 3.6 hole 3.5: 1(0,0)
Pad_e8989
  round 3.6 hole 3.5: 1(0,0)
Pad_e8990
  round 3.6 hole 3.5: 1(0,0)
Pad_e8991
  round 3.6 hole 3.5: 1(0,0)
Regulador de Tensão SDB628 Step Up
  round 2 hole 1: 1(3,5) 2(3,12.8) 3(33.5,5) 4(33.5,12.8)
RES-TH_BD2.3-L6.5-P10.50-D0.5
  round 1.4 hole 0.7: 1(-5.25,0) 2(5.25,0)
TMC2208
  round 2 hole 1: CLK(3.81,9.064) DIR(3.81,4.064) EN(3.81,21.564) GD(16.31,4.064) GND(16.31,19.064) M1A(16.31,14.064) M1O(16.31,16.564) M2A(16.31,11.564) M2B(16.31,9.064) MS1(3.81,19.064) MS2(3.81,16.564) PDN(3.81,14.064) STEP(3.81,6.564) USART(3.81,11.564) VIO(16.31,6.564) VMOT(16.31,21.564)
TO-220-3_L9.9-W4.5-P2.54-L-1
  rect 1.8x2.6 hole 1.25: 1(-2.54,0.005)
  oval 1.8x2.6 hole 1.25: 2(0,0.005) 3(2.54,-0.005)
TO-220-3_L10.0-W4.5-P2.54-L
  rect 1.8x2.6 hole 1.2: 1(-2.54,0.005)
  oval 1.8x2.6 hole 1.2: 2(0,0.005) 3(2.54,-0.005)

## Nets
As in the schematic, except:
GND: BATERIA.1 C1.2 C2.2 C3.2 C4.2 C5.2 C6.2 C7.2 C8.1 C9.1 C10.2 C11.1 C12.1 C13.1 C14.1 CARREGADOR.1 H1.2 MD1.2 MD1.4 MD2.2 MD2.4 MD3.GND MD3.N MD4.4 MD5.GD MD5.GND MD6.GD MD6.GND MD7.1 MD8.3 MD9.3 NOREF#3.1 NOREF#4.1 Q2.3 Q4.3 R2.1 R3.1 R5.1 R6.1 S1.1
$1N15197: MD5.GPIO5 Q3.1 R5.2

Pads without a net: MD5 EN GPIO1 GPIO3 GPIO12 GPIO13 GPIO14 GPIO26 GPIO27 GPIO32 GPIO33 GPIO35 GPIO36 GPIO39; MD6 CLK MS1 MS2 PDN USART; NOREF 1; NOREF#2 1; NOREF#5 1; NOREF#6 1

## Via types
v1: diameter 0.61, hole 0.305, Top Layer to Bottom Layer, 4 vias

## Routing (per net, layer and track width the routed paths; a pad name or vN(x,y) marks a point on that pad's centre or on a via; arc(x,y) is an arc through that point)
GND: length 13.8
  Top Layer w1.25: NOREF#4.1 88.27,90.31 S1.1 ; NOREF#3.1 127.38,78.19 MD5.GD
$1N321: length 53.4
  Top Layer w1.25: 22.37,18.8 22.37,9.81 F1.2 ; 22.37,18.8 33.1,18.8 D1.1 ; 22.37,18.8 16.12,25.05 C1.1
  Bottom Layer w1.25: C1.1 15.89,25.05 Q1.3
$1N912: length 19.3
  Top Layer w1.25: R2.2 R1.2 16.23,36.09 23.5,28.82 23.5,27.57
$1N4114: length 45.5
  Bottom Layer w1.25: 73.54,72.38 73.54,71.13 58.72,56.31 58.7,56.31 57.87,55.47 57.87,55.45 C4.1 ; 73.54,72.38 72.3,72.38 MD1.3 ; 73.54,72.38 76.07,74.91 F2.2
$1N4194: length 32.6
  Top Layer w1.25: F2.1 69.02,59.53 D5.2
$1N4395: length 80
  Top Layer w1.25: 81.02,36.06 72.05,36.06 MD2.3 ; 81.02,36.06 81.02,37.31 87.27,43.56 C6.1 ; 81.02,36.06 81.02,32.31 ; L1.1 81.02,32.08 81.02,32.31 ; 81.02,32.31 93.18,32.31 C9.2 120.27,7.76 M1.2
$1N4510: length 27.2
  Bottom Layer w1.25: C8.2 81.17,6.64 C7.1 81.17,18.3 ; MD3.VCC 87.43,18.3 81.17,18.3 ; 81.17,18.3 L1.2
$1N7454: length 14
  Bottom Layer w1.25: MD4.3 32.2,99.06 R4.1
$1N8461: length 86.9
  Top Layer w1.25: v1(82.9,78.83) 62.9,98.83 v1(62.9,100.08)
  Bottom Layer w1.25: MD5.GPIO22 96.95,77.88 95.4,76.33 85.4,76.33 v1(82.9,78.83) ; MD4.1 29.62,104.82 41.26,104.82 MD8.1 46,105.08 57.25,105.08 59.75,102.58 60.4,102.58 v1(62.9,100.08)
$1N8467: length 92.1
  Top Layer w1.25: 45.91,103.57 45.91,102.71 MD8.2 ; 45.91,103.57 47.16,104.82 61.94,104.82 63.06,103.7 MD9.2 80.56,84.95 85.56,84.95 94.31,76.2 103.06,76.2 104.45,77.58 MD5.GPIO21 ; 45.91,103.57 44.66,104.82 32.16,104.82 MD4.2
$1N9630: length 29.2
  Bottom Layer w1.25: 127.02,43.69 120.86,43.69 119.61,44.94 118.36,44.94 117.11,43.69 C10.1 110.48,42.44 110.42,42.37 ; 127.02,43.69 C11.2 ; 127.02,43.69 129.45,46.11 MD5.VIN
$1N9640: length 190.4
  Top Layer w1.25: Q3.3 106.11,42.37 97.92,42.37 92.62,47.67 92.62,72.19 D5.1
  Bottom Layer w1.25: 68.61,102.45 70.35,100.71 77.85,100.71 ; 68.61,102.45 MD9.4 ; 68.61,102.45 60.03,93.87 C13.2 51.37,97.62 ; D5.1 82.62,90.94 77.85,95.71 77.85,100.71 ; 77.85,100.71 MD7.2 80.35,105.01 95.35,105.01 103.26,97.1 MD6.VMOT ; 51.37,97.62 51.37,102.33 MD8.4 ; 51.37,97.62 48.71,97.62 C14.2 37.38,93.74 R4.2
$1N9844: length 76.2
  Top Layer w1.25: MD6.VIO 127.04,92.1 133.2,85.94 133.2,82.38 MD5.3V3
  Bottom Layer w1.25: 103.37,94.04 R7.2 120.23,89.04 127.04,95.85 MD6.VIO ; 103.37,94.04 99.23,98.19 C12.2 ; 103.37,94.04 103.37,91.54 97.12,85.29 90.74,85.29 S1.3
$1N10485: length 18.3
  Top Layer w1.25: MD6.M2A 122.04,98.35 120.79,99.6 111.24,99.6 M2.3
$1N10698: length 43
  Bottom Layer w1.25: MD5.GPIO19 106.95,79.88 105.57,81.26 91.64,81.26 87.89,85.01 87.89,95.01 MD7.3
$1N10715: length 28.7
  Top Layer w1.25: MD7.4 82.93,90.14 MD5.GPIO23
$1N10748: length 62.4
  Top Layer w1.25: MD5.GPIO15 124.58,78.76 124.58,80.01 125.83,81.26 129.26,81.26 131.76,83.76 131.76,85.01 129.26,87.51 113.01,87.51 98.01,102.51 MD7.6
$1N11007: length 22.3
  Bottom Layer w1.25: 124.29,17.97 124.29,16.69 Q4.1 ; 124.29,17.97 124.29,19.22 121.79,21.72 Q3.2 ; 124.29,17.97 132.07,17.97 R6.2
$1N11460: length 13.6
  Bottom Layer w1.25: Q4.2 122.3,8.27 M1.1
$1N15197: length 66
  Bottom Layer w1.25: 126.54,31.43 R5.2 ; 126.54,31.43 Q3.1 ; 126.54,31.43 126.54,40.18 131.54,45.18 131.54,58.93 111.95,78.52 MD5.GPIO5
$1N15204: length 34.5
  Top Layer w1.25: v1(104.22,85.01) 97.97,91.26 96.72,91.26 MD7.5
  Bottom Layer w1.25: v1(104.22,85.01) 109.45,79.78 MD5.GPIO18
$1N15211: length 27.2
  Bottom Layer w1.25: MD5.GPIO17 114.45,78.44 117.04,75.85 129.54,75.85 132.04,78.35 132.04,82.1 MD6.DIR
$1N15215: length 32.4
  Top Layer w1.25: v1(110.7,80.85) 115.7,80.85 116.95,79.6 MD5.GPIO16
  Bottom Layer w1.25: MD6.STEP 127.04,85.85 125.79,87.1 111.95,87.1 109.45,84.6 109.45,82.1 v1(110.7,80.85)
$1N15225: length 14.6
  Bottom Layer w1.25: MD6.EN 112.04,82.1 113.29,80.85 120.97,80.85 121.95,79.88 MD5.GPIO2
$1N15233: length 35.1
  Top Layer w1.25: R7.1 104.22,82.7 117.87,82.7 119.45,81.13 MD5.GPIO4
  Bottom Layer w1.25: S1.2 96.6,87.77 R7.1
$1N16744: length 23.9
  Bottom Layer w1.25: MD5.GPIO34 101.95,39.08 104.45,36.58 104.45,30.78 MD3.OUT
$1N18247: length 19.8
  Top Layer w1.25: MD6.M2B 124.54,99.6 119.54,104.6 110.68,104.6 M2.4
$1N18259: length 16.4
  Bottom Layer w1.25: M2.2 108.33,107.33 F3.1
$1N18264: length 5.2
  Bottom Layer w1.25: MD6.M1A 119.54,102.22 F3.2
$1N18269: length 18.4
  Bottom Layer w1.25: MD6.M1O 117.04,98.35 114.54,100.85 104.91,100.85 M2.1
$1N18350: length 27
  Top Layer w1.25: BATERIA.2 54.72,6.64 66.06,6.64 MEDIDOR.1
  Bottom Layer w1.25: F1.1 44.19,9.03 BATERIA.2
$1N18358: length 25.9
  Bottom Layer w1.25: MEDIDOR.2 58.64,21.64 54.89,21.64 53.72,22.81 Q2.2
$1N24733: length 34.1
  Top Layer w1.25: 25.87,26.19 24.62,24.94 22.34,24.94 20.95,26.32 20.95,27.57 ; 25.87,26.19 32.12,26.19 38.37,19.94 C2.1 ; 25.87,26.19 25.87,30.08 D4.2
$1N27613: length 52.8
  Bottom Layer w1.25: R1.1 3.51,24.41 10.27,17.65 ; D2.2 28.7,27.27 D1.2 19.09,17.65 10.27,17.65 ; CARREGADOR.2 10.27,17.65
$1N27677: length 79.2
  Top Layer w1.25: Q2.1 51.18,24.53 53.68,27.03 ; 51.18,48.28 51.18,55.59 D3.1 ; 51.18,48.28 28.76,48.28 D2.1 ; 51.18,48.28 51.18,42.03 53.68,39.53 53.68,27.03 ; 53.68,27.03 71.96,27.03 R3.2
$1N27773: length 26
  Top Layer w1.25: H1.1 124.22,44.08 119.45,44.08 111.95,51.58 MD5.GPIO25
$1N29243: length 12.7
  Bottom Layer w1.25: D4.1 19.12,50.44 BOTÃO.1
$1N29257: length 95
  Bottom Layer w1.25: C5.1 39.66,36.39 MD2.1 36.76,40.85 D3.2 36.4,56.77 28.06,56.77 26.81,55.52 ; 26.81,55.52 BOTÃO.2 8.23,55.52 6.37,57.38 6.37,82.62 7.62,83.88 MD1.1 ; 26.81,55.52 C3.1

## Copper pours and planes (outline as drawn; the poured copper is in the pictures)
GND on Bottom Layer: 0,110 135,110 135,0 0,0

## Text on the board
Top Silkscreen Layer: GND | DQ | VCC | P | SCL | SDA | MISO | MOSI | SCK | CS | MDPRA - REV01 | S | D | G | IN+ | IN- | OUT- | OUT+ | EN | STEP | DIR | 3V3 | VIN | OUT      IN | +   - | +    - | +  -
